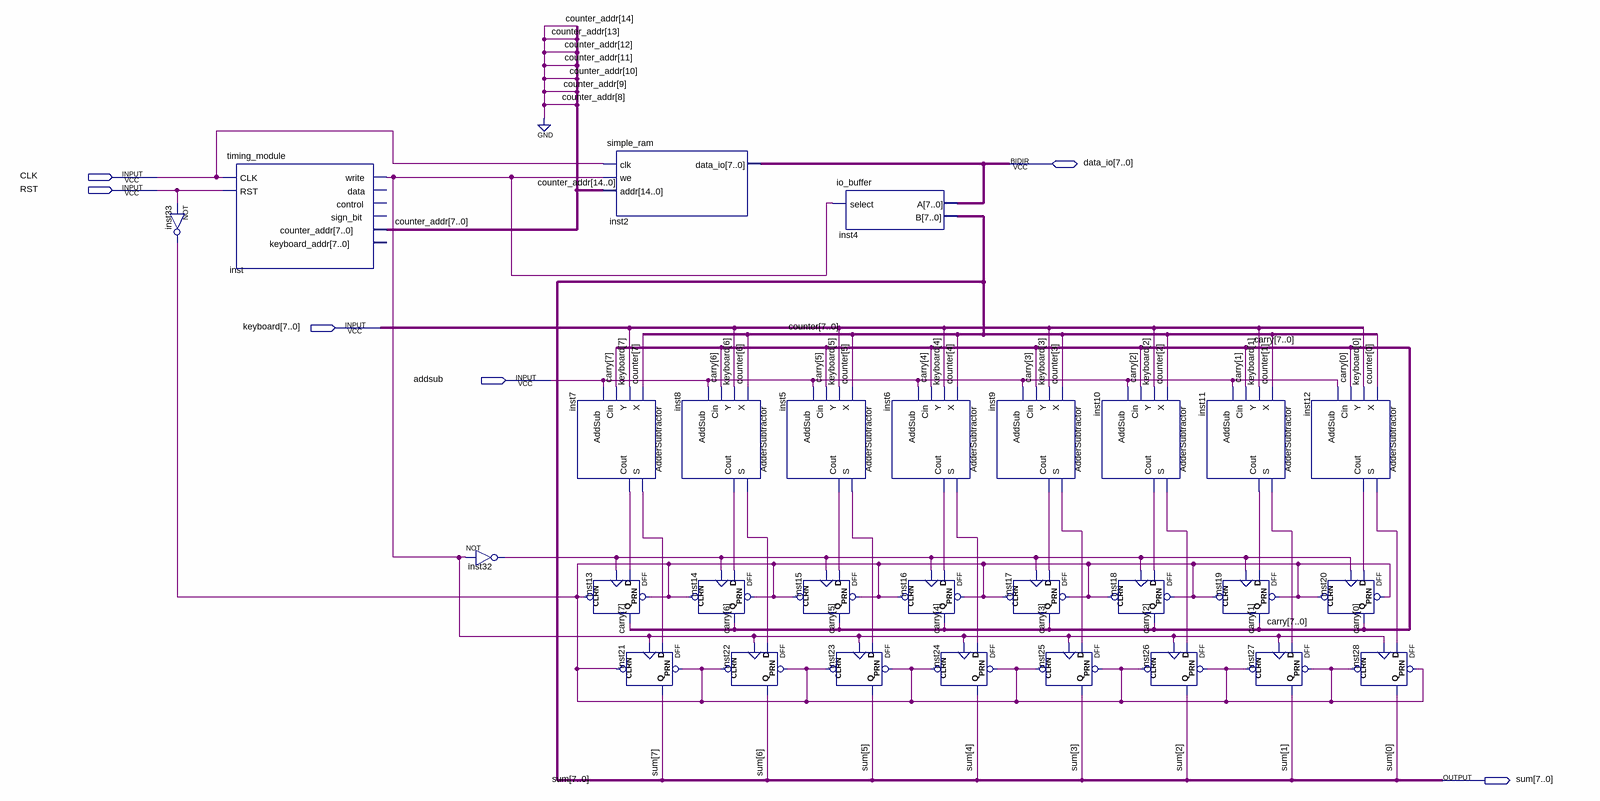
[diagram p0: schematic sheet]
// Quartus schematic test.bdf as structural Verilog: 29 symbols, 6 pins
module test (
  input  CLK,
  input  RST,
  input  [7:0] keyboard,
  input  addsub,
  inout  [7:0] data_io,
  output [7:0] sum
);

  wire inst5_cout, inst5_s, inst6_cout, inst6_s, inst7_cout, inst7_s, inst8_cout, inst8_s, inst9_cout,
       inst9_s, inst10_cout, inst10_s, inst11_cout, inst11_s, inst12_cout, inst12_s, inst32_out, inst33_out,
       inst_write;
  wire [7:0] carry, counter, counter_addr;

  not inst33 (inst33_out, RST);
  timing_module inst (
    .CLK(CLK), .RST(RST), .write(inst_write), .counter_addr(counter_addr));  // open: data, control, sign_bit, keyboard_addr
  not inst32 (inst32_out, inst_write);
  AdderSubtractor inst7 (
    .X(counter[7]), .Y(keyboard[7]), .Cin(carry[7]), .AddSub(addsub), .S(inst7_s), .Cout(inst7_cout));
  DFF inst13 (.CLRN(inst33_out), .CLK(inst32_out), .D(inst7_cout), .PRN(inst33_out), .Q(carry[7]));
  simple_ram inst2 (.clk(CLK), .we(inst_write), .addr({{7{1'b0}}, counter_addr}), .data_io(data_io));
  DFF inst21 (.CLRN(inst33_out), .CLK(inst_write), .D(inst7_s), .PRN(inst33_out), .Q(sum[7]));
  AdderSubtractor inst8 (
    .X(counter[6]), .Y(keyboard[6]), .Cin(carry[6]), .AddSub(addsub), .S(inst8_s), .Cout(inst8_cout));
  DFF inst14 (.CLRN(inst33_out), .CLK(inst32_out), .D(inst8_cout), .PRN(inst33_out), .Q(carry[6]));
  DFF inst22 (.CLRN(inst33_out), .CLK(inst_write), .D(inst8_s), .PRN(inst33_out), .Q(sum[6]));
  AdderSubtractor inst5 (
    .X(counter[5]), .Y(keyboard[5]), .Cin(carry[5]), .AddSub(addsub), .S(inst5_s), .Cout(inst5_cout));
  DFF inst15 (.CLRN(inst33_out), .CLK(inst32_out), .D(inst5_cout), .PRN(inst33_out), .Q(carry[5]));
  io_buffer inst4 (.select(inst_write), .A(data_io), .B(sum));
  DFF inst23 (.CLRN(inst33_out), .CLK(inst_write), .D(inst5_s), .PRN(inst33_out), .Q(sum[5]));
  AdderSubtractor inst6 (
    .X(counter[4]), .Y(keyboard[4]), .Cin(carry[4]), .AddSub(addsub), .S(inst6_s), .Cout(inst6_cout));
  DFF inst16 (.CLRN(inst33_out), .CLK(inst32_out), .D(inst6_cout), .PRN(inst33_out), .Q(carry[4]));
  DFF inst24 (.CLRN(inst33_out), .CLK(inst_write), .D(inst6_s), .PRN(inst33_out), .Q(sum[4]));
  AdderSubtractor inst9 (
    .X(counter[3]), .Y(keyboard[3]), .Cin(carry[3]), .AddSub(addsub), .S(inst9_s), .Cout(inst9_cout));
  DFF inst17 (.CLRN(inst33_out), .CLK(inst32_out), .D(inst9_cout), .PRN(inst33_out), .Q(carry[3]));
  DFF inst25 (.CLRN(inst33_out), .CLK(inst_write), .D(inst9_s), .PRN(inst33_out), .Q(sum[3]));
  AdderSubtractor inst10 (
    .X(counter[2]), .Y(keyboard[2]), .Cin(carry[2]), .AddSub(addsub), .S(inst10_s), .Cout(inst10_cout));
  DFF inst18 (.CLRN(inst33_out), .CLK(inst32_out), .D(inst10_cout), .PRN(inst33_out), .Q(carry[2]));
  DFF inst26 (.CLRN(inst33_out), .CLK(inst_write), .D(inst10_s), .PRN(inst33_out), .Q(sum[2]));
  AdderSubtractor inst11 (
    .X(counter[1]), .Y(keyboard[1]), .Cin(carry[1]), .AddSub(addsub), .S(inst11_s), .Cout(inst11_cout));
  DFF inst19 (.CLRN(inst33_out), .CLK(inst32_out), .D(inst11_cout), .PRN(inst33_out), .Q(carry[1]));
  DFF inst27 (.CLRN(inst33_out), .CLK(inst_write), .D(inst11_s), .PRN(inst33_out), .Q(sum[1]));
  AdderSubtractor inst12 (
    .X(counter[0]), .Y(keyboard[0]), .Cin(carry[0]), .AddSub(addsub), .S(inst12_s), .Cout(inst12_cout));
  DFF inst20 (.CLRN(inst33_out), .CLK(inst32_out), .D(inst12_cout), .PRN(inst33_out), .Q(carry[0]));
  DFF inst28 (.CLRN(inst33_out), .CLK(inst_write), .D(inst12_s), .PRN(inst33_out), .Q(sum[0]));
endmodule
